# Altium schematic sheet support.SchDoc: Support
size A4; DrawnBy: Edward H and Maggie Z
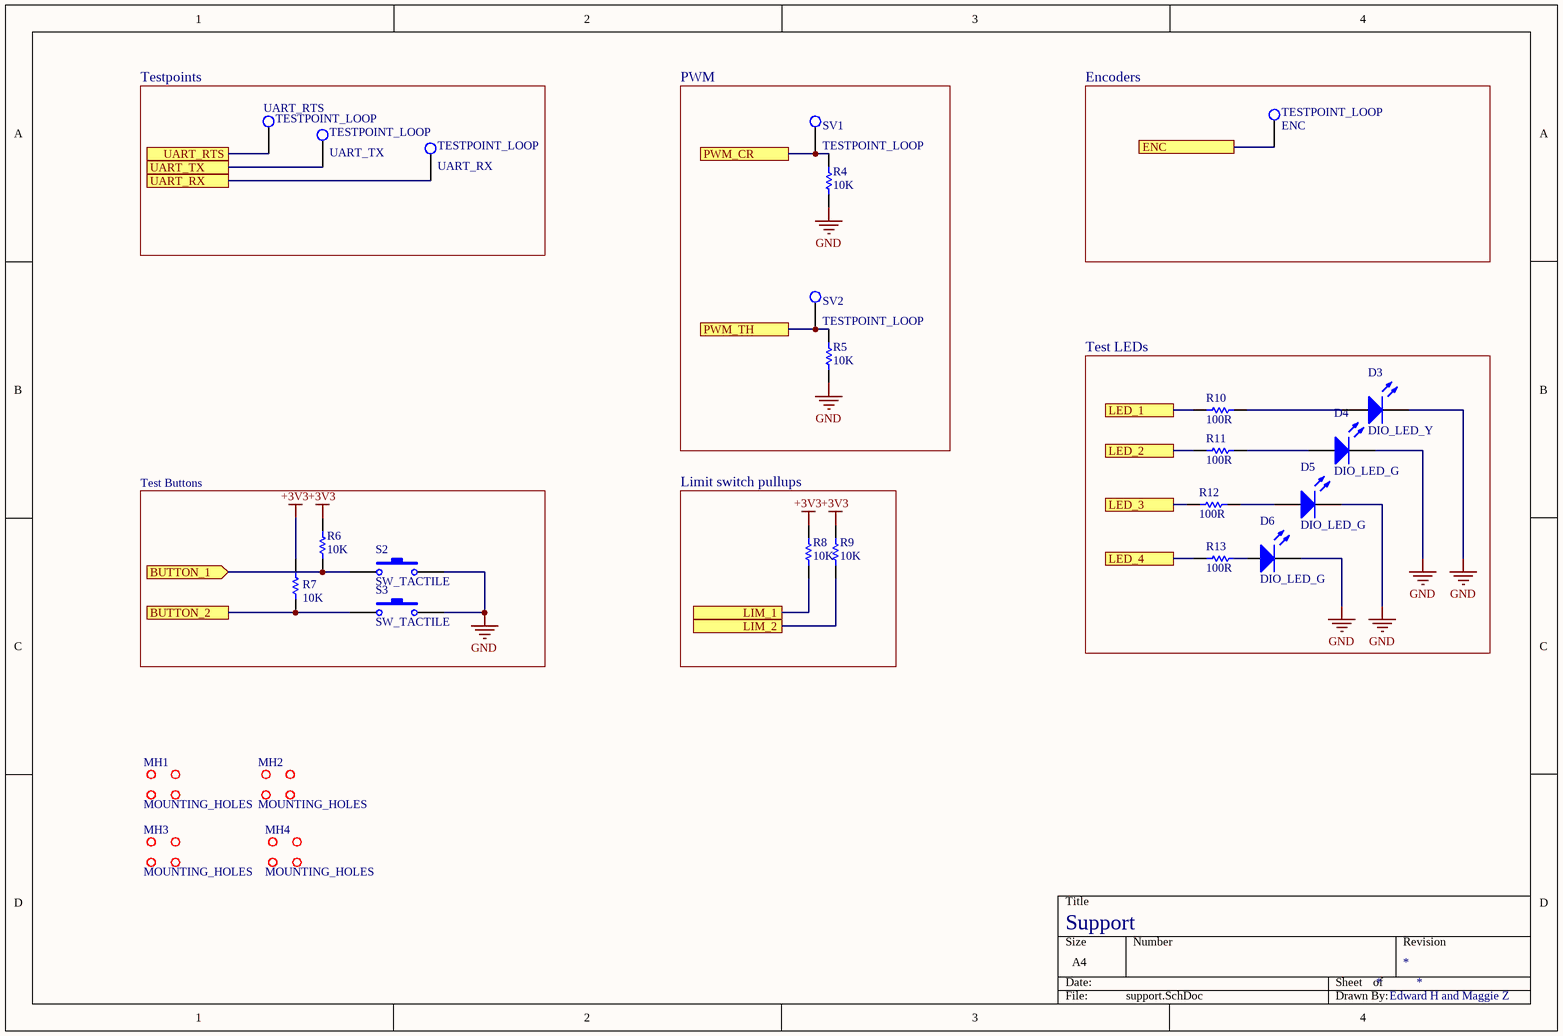
[diagram p0: support.SchDoc]

## Parts
D3  DIO_LED_Y  [LED_0805_LINE]
D4  DIO_LED_G  [LED_0805_LINE]
D5  DIO_LED_G  [LED_0805_LINE]
D6  DIO_LED_G  [LED_0805_LINE]
ENC  TESTPOINT_LOOP  [TESTPOINT_LOOP]
MH1  MOUNTING_HOLES  [MOUNTING_HOLE]
MH2  MOUNTING_HOLES  [MOUNTING_HOLE]
MH3  MOUNTING_HOLES  [MOUNTING_HOLE]
MH4  MOUNTING_HOLES  [MOUNTING_HOLE]
R4  value 10K  [RESC0603(1608)_N]  (hidden comment: RES_10K_0603)
R5  value 10K  [RESC0603(1608)_N]  (hidden comment: RES_10K_0603)
R6  value 10K  [RESC0603(1608)_N]  (hidden comment: RES_10K_0603)
R7  value 10K  [RESC0603(1608)_N]  (hidden comment: RES_10K_0603)
R8  value 10K  [RESC0603(1608)_N]  (hidden comment: RES_10K_0603)
R9  value 10K  [RESC0603(1608)_N]  (hidden comment: RES_10K_0603)
R10  value 100R  [RESC0603(1608)_N]  (hidden comment: RES_100R_0603)
R11  value 100R  [RESC0603(1608)_N]  (hidden comment: RES_100R_0603)
R12  value 100R  [RESC0603(1608)_N]  (hidden comment: RES_100R_0603)
R13  value 100R  [RESC0603(1608)_N]  (hidden comment: RES_100R_0603)
S2  SW_TACTILE  [B3U-1100P]
S3  SW_TACTILE  [B3U-1100P]
SV1  TESTPOINT_LOOP  [TESTPOINT_LOOP]
SV2  TESTPOINT_LOOP  [TESTPOINT_LOOP]
UART_RTS  TESTPOINT_LOOP  [TESTPOINT_LOOP]
UART_RX  TESTPOINT_LOOP  [TESTPOINT_LOOP]
UART_TX  TESTPOINT_LOOP  [TESTPOINT_LOOP]

## Blocks framed on the sheet
Testpoints: UART_RTS UART_RX UART_TX
PWM: R4 R5 SV1 SV2
Encoders: ENC
Test LEDs: D3-D6 R10-R13
Test Buttons: R6 R7 S2 S3
Limit switch pullups: R8 R9

## Ports
BUTTON_1 (in), BUTTON_2, ENC, LED_1, LED_2, LED_3, LED_4, LIM_1, LIM_2, PWM_CR, PWM_TH, UART_RTS, UART_RX, UART_TX

## Nets
+3V3: R6.2 R7.1 R8.2 R9.2
GND: D3.2(K) D4.2(K) D5.2(K) D6.2(K) R4.1 R5.1 S2.2 S3.2
BUTTON_1: R6.1 S2.1 ; port BUTTON_1
BUTTON_2: R7.2 S3.1 ; port BUTTON_2
ENC: ENC.1(=value) ; port ENC
LED_1: R10.2 ; port LED_1
LED_2: R11.2 ; port LED_2
LED_3: R12.2 ; port LED_3
LED_4: R13.2 ; port LED_4
LIM_1: R8.1 ; port LIM_1
LIM_2: R9.1 ; port LIM_2
PWM_CR: R4.2 SV1.1(=value) ; port PWM_CR
PWM_TH: R5.2 SV2.1(=value) ; port PWM_TH
UART_RTS: UART_RTS.1(=value) ; port UART_RTS
UART_RX: UART_RX.1(=value) ; port UART_RX
UART_TX: UART_TX.1(=value) ; port UART_TX
NetD3_1: D3.1(A) R10.1
NetD4_1: D4.1(A) R11.1
NetD5_1: D5.1(A) R12.1
NetD6_1: D6.1(A) R13.1

## Library data of the parts
D3 = DIO_LED_Y: LED YELLOW DIFFUSED 0805 SMD; Manufacturer: OSRAM; MPN: LY R976-PS-36; Forward Voltage Drop: 2.2V; Package: 0805 (2012 Metric); Digikey Part Number: 475-2560-1-ND
D4-D6 = DIO_LED_G: LED GREEN DIFFUSED 0805 SMD; Manufacturer: OSRAM; MPN: LG R971-KN-1; Forward Voltage Drop: 2.2V; Package: 0805 (2012 Metric); Digikey Part Number: 475-1410-1-ND
MH1-MH4 = MOUNTING_HOLES: 6cm x 6cm
R4-R9 = RES_10K_0603: RES SMD 10K OHM 5% 1/10W 0603; Manufacturer: Yageo; MPN: RC0603JR-0710KL; Package: 0603 (1608 Metric); Dimensions: 0.063" L x 0.031" W (1.60mm x 0.80mm); Tolerance: 5%; Digikey Part Number: 311-10KGRCT-ND
R10-R13 = RES_100R_0603: RES SMD 100 OHM 1% 1/10W 0603; Manufacturer: Yageo; MPN: RC0603FR-07100RL; Package: 0603 (1608 Metric); Dimensions: 0.063" L x 0.031" W (1.60mm x 0.80mm); Tolerance: 1%; Digikey Part Number: 311-100HRCT-ND
S2 S3 = SW_TACTILE: Tactile Switch (Grey); Manufacturer: Omron Electronics Inc-EMC Div; Digikey Part Number: SW1021TR-ND; MPN: B3U-1100P